# EAGLE schematic Controller_v.1 (EAGLE 6.4)
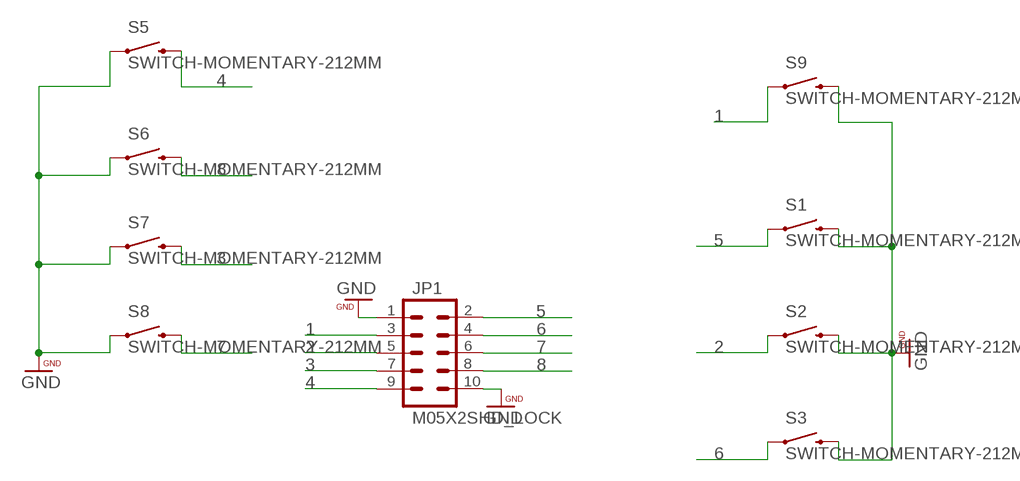
[diagram p0: schematic, sheet 1]

## Parts
JP1  M05X2SHD_LOCK  [2X5-SHROUDED_LOCK]
S1  SWITCH-MOMENTARY-212MM  [TACTILE-PTH-12MM]
S2  SWITCH-MOMENTARY-212MM  [TACTILE-PTH-12MM]
S3  SWITCH-MOMENTARY-212MM  [TACTILE-PTH-12MM]
S5  SWITCH-MOMENTARY-212MM  [TACTILE-PTH-12MM]
S6  SWITCH-MOMENTARY-212MM  [TACTILE-PTH-12MM]
S7  SWITCH-MOMENTARY-212MM  [TACTILE-PTH-12MM]
S8  SWITCH-MOMENTARY-212MM  [TACTILE-PTH-12MM]
S9  SWITCH-MOMENTARY-212MM  [TACTILE-PTH-12MM]

## Nets
1: JP1.3 S9.1
2: JP1.5 S2.1
3: JP1.7 S7.3
4: JP1.9 S5.3
5: JP1.2 S1.1
6: JP1.4 S3.1
7: JP1.6 S8.3
8: JP1.8 S6.3
GND: JP1.1 JP1.10 S1.3 S2.3 S3.3 S5.1 S6.1 S7.1 S8.1 S9.3

## Library data of the parts
JP1 = SparkFun-Connectors:M05X2: Header 5x2 Standard 10-pin dual row 0.1" header. Commonly used with AVR-ISP. Use with Spark Fun Electronics SKU: PRT-00778
S1-S3 S5-S9 = SparkFun-Electromechanical:SWITCH-MOMENTARY-2: Various NO switches- pushbuttons, reed, etc; PROD_ID: SWCH-09185